# Altium schematic sheet dimmer_v2.SchDoc
size A1
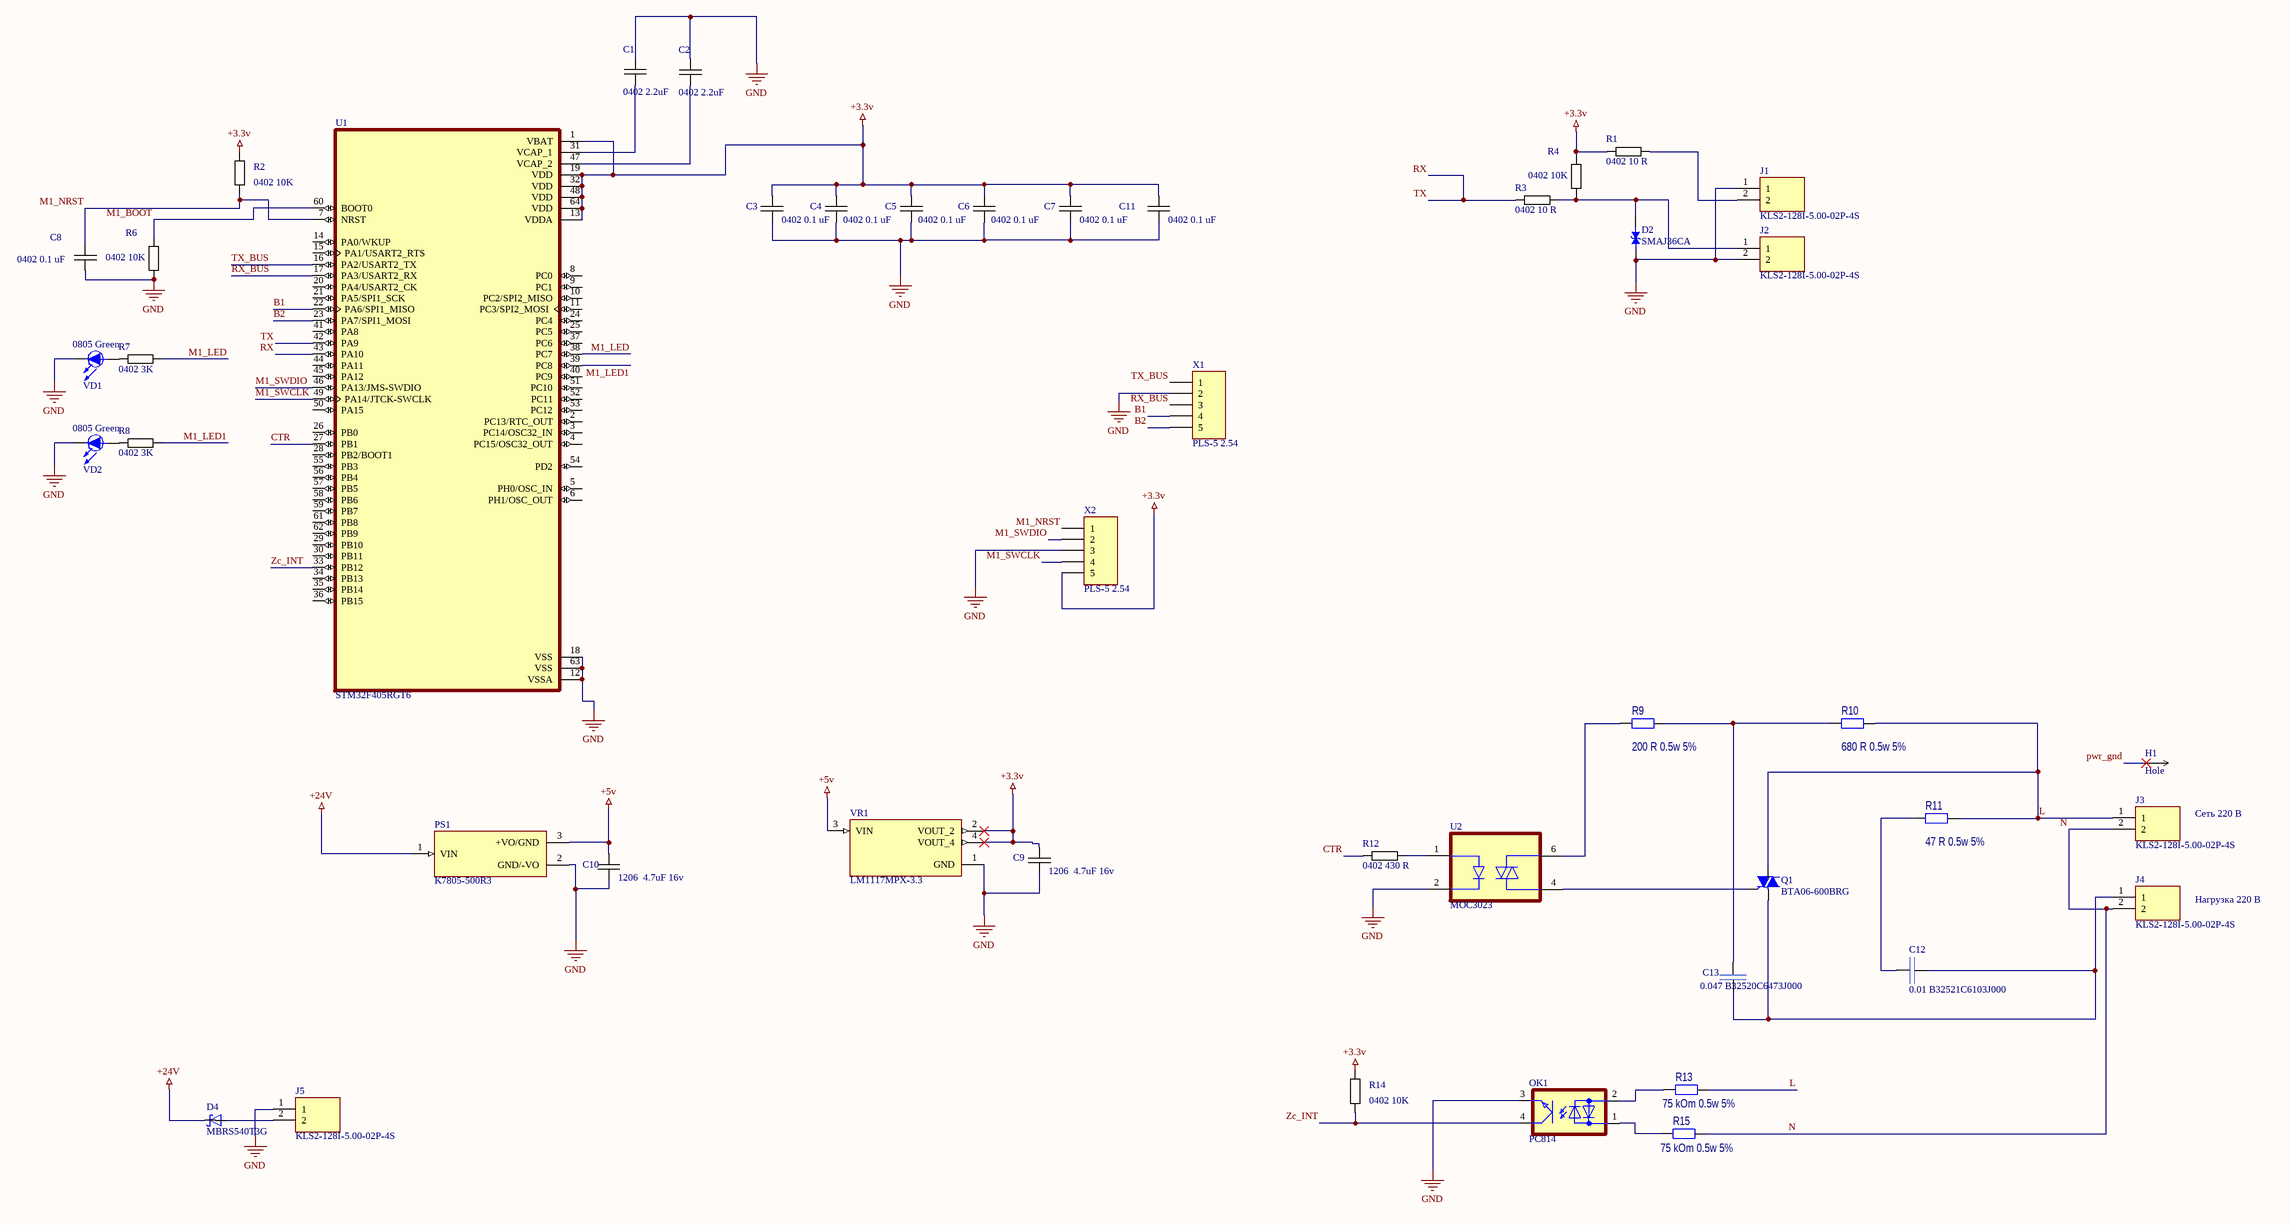
[diagram p0: dimmer_v2.SchDoc]

## Parts
C1  0402 2.2uF  [CAPACITOR 0402]
C2  0402 2.2uF  [CAPACITOR 0402]
C3  0402 0.1 uF  [CAPACITOR 0402]
C4  0402 0.1 uF  [CAPACITOR 0402]
C5  0402 0.1 uF  [CAPACITOR 0402]
C6  0402 0.1 uF  [CAPACITOR 0402]
C7  0402 0.1 uF  [CAPACITOR 0402]
C8  0402 0.1 uF  [CAPACITOR 0402]
C9  1206  4.7uF 16v  [CAPACITOR 1206]
C10  1206  4.7uF 16v  [CAPACITOR 1206]
C11  0402 0.1 uF  [CAPACITOR 0402]
C12  0.01 B32521C6103J000  [CAPRR1000W60L1300T400H900]
C13  0.047 B32520C6473J000  [CAPRR1000W60L1300T400H900]
D2  SMAJ36CA  [DIOM4325X250N]
D4  MBRS540T3G  [DIOM7958X213N]
H1  Hole  [Hole 1.5]
J1  KLS2-128I-5.00-02P-4S  [CUI_TB003-500-P02BE]
J2  KLS2-128I-5.00-02P-4S  [CUI_TB003-500-P02BE]
J3  KLS2-128I-5.00-02P-4S  [CUI_TB003-500-P02BE]
J4  KLS2-128I-5.00-02P-4S  [CUI_TB003-500-P02BE]
J5  KLS2-128I-5.00-02P-4S  [CUI_TB003-500-P02BE]
OK1  PC814  [DIL04]
PS1  K7805-500R3  [CONV_K7805-500R3]
Q1  BTA06-600BRG  [TO254P1040X460X1975-3]
R1  0402 10 R  [Resistor 0402]
R2  0402 10K  [Resistor 0402]
R3  0402 10 R  [Resistor 0402]
R4  0402 10K  [Resistor 0402]
R6  0402 10K  [Resistor 0402]
R7  0402 3K  [Resistor 0402]
R8  0402 3K  [Resistor 0402]
R9  200 R 0.5w 5%  [MF-200 V]
R10  680 R 0.5w 5%  [MF-200 V]
R11  47 R 0.5w 5%  [MF-200 V]
R12  0402 430 R  [Resistor 0402]
R13  75 kOm 0.5w 5%  [MF-200 V]
R14  0402 10K  [Resistor 0402]
R15  75 kOm 0.5w 5%  [MF-200 V]
U1  STM32F405RGT6  [QFP50P1200X1200X160-64N]
U2  MOC3023  [DIP762W48P254L889H508Q6]
VD1  0805 Green  [0805-]
VD2  0805 Green  [0805-]
VR1  LM1117MPX-3.3  [VREG_LM1117MPX-3.3]
X1  PLS-5 2.54  [PLS-5-3D]
X2  PLS-5 2.54  [PLS-5-3D]

## Nets
+3.3v: C3.1 C4.1 C5.1 C6.1 C7.1 C9.1 C11.1 R1.2 R2.2 R4.1 R14.2 U1.1(VBAT) U1.13(VDDA) U1.19(VDD) U1.32(VDD) U1.48(VDD) U1.64(VDD) VR1.2(VOUT_2) VR1.4(VOUT_4) X2.5
+5v: C10.1 PS1.3(+VO/GND) VR1.3(VIN)
+24V: D4.C PS1.1(VIN)
GND: C1.1 C2.1 C3.2 C4.2 C5.2 C6.2 C7.2 C8.1 C9.2 C10.2 C11.2 D2.2 J1.1 J2.2 J5.1 OK1.3(E) PS1.2(GND/-VO) R6.2 U1.12(VSSA) U1.18(VSS) U1.63(VSS) U2.2(CATHODE) VD1.K(k) VD2.K(k) VR1.1(GND) X1.2 X2.3
B1: U1.22(PA6/SPI1_MISO) X1.4
B2: U1.23(PA7/SPI1_MOSI) X1.5
CTR: R12.2 U1.27(PB1)
L: J3.1 Q1.2(A2) R10.2 R11.2 R13.2
M1_BOOT: R6.1 U1.60(BOOT0)
M1_LED: R7.1 U1.38(PC7)
M1_LED1: R8.1 U1.39(PC8)
M1_NRST: C8.2 R2.1 U1.7(NRST) X2.1
M1_SWCLK: U1.49(PA14/JTCK-SWCLK) X2.4
M1_SWDIO: U1.46(PA13/JMS-SWDIO) X2.2
N: J3.2 J4.2 R15.2
pwr_gnd: H1.0
RX: R3.2 U1.42(PA9) U1.43(PA10)  [also labelled TX]
RX_BUS: U1.17(PA3/USART2_RX) X1.3
TX_BUS: U1.16(PA2/USART2_TX) X1.1
Zc_INT: OK1.4(C) R14.1 U1.33(PB12)
NetC1_2: C1.2 U1.31(VCAP_1)
NetC2_2: C2.2 U1.47(VCAP_2)
NetC12_1: C12.1 C13.2 J4.1 Q1.1(A1)
NetC12_2: C12.2 R11.1
NetC13_1: C13.1 R9.2 R10.1
NetD2_1: D2.1 J2.1 R3.1 R4.2
NetD4_A: D4.A J5.2
NetJ1_2: J1.2 R1.1
NetOK1_1: OK1.1(AC1) R15.1
NetOK1_2: OK1.2(AC2) R13.1
NetQ1_3: Q1.3(G) U2.4(MAINTERMINAL_1)
NetR7_2: R7.2 VD1.A(a)
NetR8_2: R8.2 VD2.A(a)
NetR9_1: R9.1 U2.6(MAINTERMINAL_2)
NetR12_1: R12.1 U2.1(ANODE)

Not connected (* = marked no-connect by the designer): U1 2(PC13/RTC_OUT) 3(PC14/OSC32_IN) 4(PC15/OSC32_OUT) 5(PH0/OSC_IN) 6(PH1/OSC_OUT) 8(PC0) 9(PC1) 10(PC2/SPI2_MISO) 11(PC3/SPI2_MOSI) 14(PA0/WKUP) 15(PA1/USART2_RTS) 20(PA4/USART2_CK) 21(PA5/SPI1_SCK) 24(PC4) 25(PC5) 26(PB0) 28(PB2/BOOT1) 29(PB10) 30(PB11) 34(PB13) 35(PB14) 36(PB15) 37(PC6) 40(PC9) 41(PA8) 44(PA11) 45(PA12) 50(PA15) 51(PC10) 52(PC11) 53(PC12) 54(PD2) 55(PB3) 56(PB4) 57(PB5) 58(PB6) 59(PB7) 61(PB8) 62(PB9)

## Notes on the sheet
- Сеть 220 В
- Нагрузка 220 В

## Library data of the parts
C1 C2 = Capasitor: Ceramic Capacitor SMD; Value: 0402 2.2uF; Package: 0402
C3-C11 = Capasitor: Ceramic Capacitor
  C3-C8 C11: Value: 0402 0.1 uF; Package: 0402
  C9 C10: Value: 1206  4.7uF 16v; Package: 1206
C12 C13 = HV_CAP: Package: B32521C6103J000
  C12: value: 0.01 B32521C6103J000
  C13: value: 0.047 B32520C6473J000
D4 = MBRS540T3G: Diode Schottky 40V 5A Surface Mount SMC; MF: ON Semiconductor; SnapEDA_Link: https://www.snapeda.com/parts/MBRS540T3G/ON%20Semiconductor/view-part/78777/?ref=snap; MP: MBRS540T3G; Availability: Unavailable; Price: None; Value: MBRS540T3G; Package: DO-214 ON Semiconductor
J1-J5 = TB003-500-P02BE: 2~24 Poles, Screw Type, Horizontal, 5.0 Pitch, 26~14 _AWG_, Terminal Block Connector; MF: CUI Devices; MP: TB003-500-P02BE; Availability: Unavailable; Package: None; SnapEDA_Link: https://www.snapeda.com/parts/TB003-500-P02BE/CUI%20Devices/view-part/3590637/?ref=snap; Price: None; Value: KLS2-128I-5.00-02P-4S
OK1 = PC814: #10-32 Round Head Machine Screw Slotted Drive Nylon; MF: Essentra Components; Package: DIP-4 Sharp; Value: PC814; Price: None; MP: PC814; Availability: Unavailable; SnapEDA_Link: https://www.snapeda.com/parts/PC814/Essentra%20Components/view-part/624045/?ref=snap
PS1 = K7805-500R3: Linear Regulator Replacement DC DC Converter 1 Output 5V, -5V - - - 500mA, 300mA 6.5V, 7V - 36V, 31V Input; MF: MORNSUN; Availability: In Stock; Check_prices: https://www.snapeda.com/parts/K7805-500R3/MORNSUN/view-part/?ref=eda; Package: SIP-3-3 MORNSUN; Price: None; SnapEDA_Link: https://www.snapeda.com/parts/K7805-500R3/MORNSUN/view-part/?ref=snap; Value: K7805-500R3; Purchase-URL: https://pricing.snapeda.com/search/part/K7805-500R3/?ref=eda; MP: K7805-500R3
Q1 = BTA06-600BRG: TRIAC Standard 600V 6A Through Hole TO-220AB; MF: STMicroelectronics; MP: BTA06-600BRG; SnapEDA_Link: https://www.snapeda.com/parts/BTA06-600BRG/STMicroelectronics/view-part/107180/?ref=snap; Availability: Unavailable; Package: TO-220 STMicroelectronics; Value: BTA06-600BRG; Price: None
R1-R4 R6-R8 R12 R14 = Resistor: Package: 0402
  R1 R3: Value: 0402 10 R
  R2 R4 R6 R14: Value: 0402 10K
  R7 R8: Value: 0402 3K
  R12: Value: 0402 430 R
R9-R11 R13 R15 = Res: Резистор; Tolerance_Percent: {Tolerance_Percent}; Class: Электронные компоненты; SubClass: Резисторы; Power_W: {Power_W}; Installation: {Installation}; Ordering_Information: {Ordering_Information}; Body: {Body}; Pins: 2
  R9: Value: 200 R 0.5w 5%
  R10: Value: 680 R 0.5w 5%
  R11: Value: 47 R 0.5w 5%
  R13 R15: Value: 75 kOm 0.5w 5%
U1 = STM32F405RGT6: High-performance foundation line, ARM Cortex-M4 core with DSP and FPU, 1 Mbyte Flash, 168 MHz CPU, ART Accelerator; MP: STM32F405RGT6; Value: STM32F405RGT6; Price: None; Package: None; Availability: Unavailable
U2 = MOC3023: Optoisolator Triac Output 5300Vrms 1 Channel 6-DIP; MF: ON Semiconductor; Price: None; Availability: In Stock; MP: MOC3023; Package: DIP-6 Texas Instruments; SnapEDA_Link: https://www.snapeda.com/parts/MOC3023/Onsemi/view-part/?ref=snap; Check_prices: https://www.snapeda.com/parts/MOC3023/Onsemi/view-part/?ref=eda; Value: MOC3023; Purchase-URL: https://pricing.snapeda.com/search/part/MOC3023/?ref=eda
VD1 VD2 = LED SMD: Green; CompType: LED; Note: Read; Value: 0805 Green; Pins: 2; Package: 0805
VR1 = LM1117MPX-3.3: 800-mA 3.3-V linear voltage regulator; MF: Texas Instruments; Check_prices: https://www.snapeda.com/parts/LM1117MPX-3.3/Texas+Instruments/view-part/?ref=eda; Value: LM1117MPX-3.3; Availability: In Stock; MP: LM1117MPX-3.3; Price: None; Package: SOT-223-4 Texas Instruments; SnapEDA_Link: https://www.snapeda.com/parts/LM1117MPX-3.3/Texas+Instruments/view-part/?ref=snap; Purchase-URL: https://pricing.snapeda.com/search/part/LM1117MPX-3.3/?ref=eda
X1 X2 = PLS-5: Header, 5-Pin; CompType: connector; Note: header pins 2.54mm x 5; Value: PLS-5 2.54; Package: 2.54 x 5; PartNumber: PLS-5; Pins: 5
D2 = SMAJ36CA: Value: SMAJ36CA; Price: None; Package: DIOM4325x250N; Availability: Unavailable; MP: SMAJ36CA